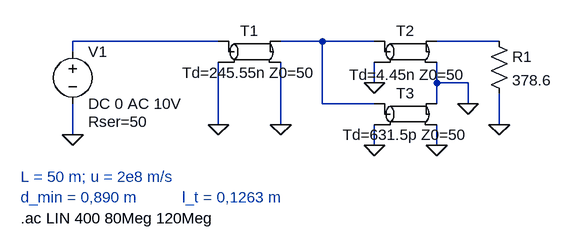
[diagram p0: schematic Q1v2.asc]
Q1v2.asc, the LTspice schematic file:
Version 4
SHEET 1 880 700
WIRE 96 128 -128 128
WIRE 256 128 192 128
WIRE 336 128 256 128
WIRE 528 128 432 128
WIRE -128 144 -128 128
WIRE 336 192 336 160
WIRE 432 192 432 160
WIRE 480 192 432 192
WIRE 256 224 256 128
WIRE 336 224 256 224
WIRE 432 224 432 192
WIRE 480 224 480 192
WIRE 96 256 96 160
WIRE 192 256 192 160
WIRE 528 256 528 208
WIRE -128 272 -128 224
WIRE 336 288 336 256
WIRE 432 288 432 256
FLAG -128 272 0
FLAG 96 256 0
FLAG 192 256 0
FLAG 528 256 0
FLAG 336 288 0
FLAG 432 288 0
FLAG 480 224 0
FLAG 336 192 0
SYMBOL tline 144 144 R0
SYMATTR InstName T1
SYMATTR Value Td=245.55n Z0=50
SYMBOL res 512 112 R0
SYMATTR InstName R1
SYMATTR Value 378.6
SYMBOL voltage -128 128 R0
WINDOW 123 0 0 Left 0
WINDOW 39 24 124 Left 2
SYMATTR SpiceLine Rser=50
SYMATTR InstName V1
SYMATTR Value DC 0 AC 10V
SYMBOL tline 384 144 R0
WINDOW 3 3 20 Top 2
SYMATTR InstName T2
SYMATTR Value Td=4.45n Z0=50
SYMBOL tline 384 240 R0
SYMATTR InstName T3
SYMATTR Value Td=631.5p Z0=50
TEXT -208 400 Left 2 !.ac LIN 400 80Meg 120Meg
TEXT -208 368 Left 2 ;d_min = 0,890 m
TEXT 40 368 Left 2 ;l_t = 0,1263 m
TEXT -208 336 Left 2 ;L = 50 m; u = 2e8 m/s

The netlist it stands for:
* Q1v2.asc
T1 N001 0 N002 0 Td=245.55n Z0=50
R1 N003 0 378.6
V1 N001 0 DC 0 AC 10V Rser=50
T2 N002 0 N003 0 Td=4.45n Z0=50
T3 N002 0 0 0 Td=631.5p Z0=50
.ac LIN 400 80Meg 120Meg
* d_min = 0,890 m
* l_t = 0,1263 m
* L = 50 m; u = 2e8 m/s
.backanno
.end